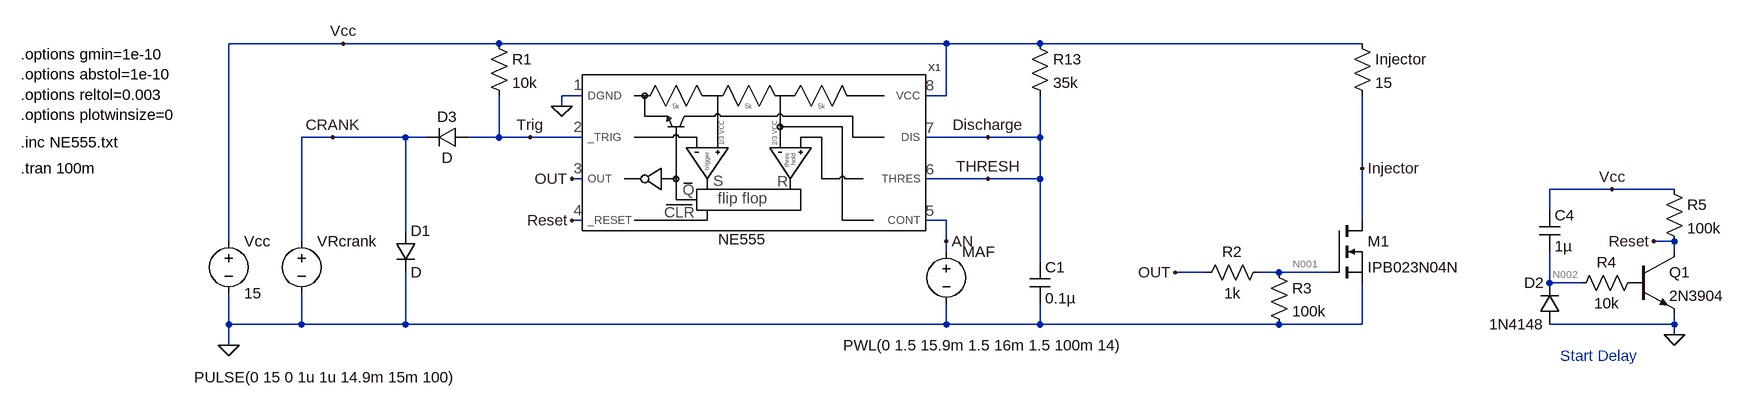
[diagram p0: schematic 555_ECU2.asc]
555_ECU2.asc, the LTspice schematic file:
Version 4
SHEET 1 1560 948
WIRE -576 0 -752 0
WIRE -336 0 -576 0
WIRE 352 0 -336 0
WIRE 496 0 352 0
WIRE 992 0 496 0
WIRE -208 80 -240 80
WIRE 352 80 352 0
WIRE 352 80 320 80
WIRE -240 96 -240 80
WIRE -592 144 -640 144
WIRE -480 144 -592 144
WIRE -448 144 -480 144
WIRE -336 144 -336 80
WIRE -336 144 -384 144
WIRE -288 144 -336 144
WIRE -208 144 -288 144
WIRE 416 144 320 144
WIRE 496 144 496 80
WIRE 496 144 416 144
WIRE 992 192 992 80
WIRE -208 208 -224 208
WIRE 416 208 320 208
WIRE 496 208 496 144
WIRE 496 208 416 208
WIRE 1376 224 1280 224
WIRE 1472 224 1376 224
WIRE 1280 256 1280 224
WIRE -208 272 -224 272
WIRE 352 272 320 272
WIRE 992 272 992 192
WIRE -480 288 -480 144
WIRE -752 304 -752 0
WIRE -640 304 -640 144
WIRE 352 304 352 272
WIRE 1472 304 1440 304
WIRE 352 320 352 304
WIRE 1472 320 1472 304
WIRE 496 336 496 208
WIRE 752 352 704 352
WIRE 864 352 832 352
WIRE 944 352 864 352
WIRE 1280 368 1280 320
WIRE 1328 368 1280 368
WIRE -752 432 -752 384
WIRE -640 432 -640 384
WIRE -640 432 -752 432
WIRE -480 432 -480 352
WIRE -480 432 -640 432
WIRE 352 432 352 400
WIRE 352 432 -480 432
WIRE 496 432 496 400
WIRE 496 432 352 432
WIRE 864 432 496 432
WIRE 992 432 992 368
WIRE 992 432 864 432
WIRE 1472 432 1472 416
WIRE 1472 432 1280 432
WIRE 1472 448 1472 432
WIRE -752 464 -752 432
FLAG -752 464 0
FLAG -224 208 OUT
FLAG -240 96 0
FLAG -592 144 CRANK
FLAG -576 0 Vcc
FLAG -224 272 Reset
FLAG 416 144 Discharge
FLAG 1472 448 0
FLAG 1376 224 Vcc
FLAG 1440 304 Reset
FLAG -288 144 Trig
FLAG 704 352 OUT
FLAG 992 192 Injector
FLAG 352 304 AN
FLAG 416 208 THRESH
SYMBOL cap 480 336 R0
SYMATTR InstName C1
SYMATTR Value 0.1µ
SYMBOL res 480 -16 R0
SYMATTR InstName R13
SYMATTR Value 35k
SYMBOL voltage -752 288 R0
SYMATTR InstName Vcc
SYMATTR Value 15
SYMBOL NE555_sketched 48 176 R0
SYMATTR InstName X1
SYMATTR Prefix ""
SYMATTR Value NE555
SYMBOL voltage -640 288 R0
WINDOW 3 -165 225 Left 2
WINDOW 123 0 0 Left 0
WINDOW 39 0 0 Left 0
SYMATTR Value PULSE(0 15 0 1u 1u 14.9m 15m 100)
SYMATTR InstName VRcrank
SYMBOL diode -496 288 R0
SYMATTR InstName D1
SYMBOL diode -384 128 R90
WINDOW 0 0 32 VBottom 2
WINDOW 3 32 32 VTop 2
SYMATTR InstName D3
SYMBOL npn 1408 320 R0
SYMATTR InstName Q1
SYMATTR Value 2N3904
SYMBOL res 1312 384 R270
WINDOW 0 32 56 VTop 2
WINDOW 3 0 56 VBottom 2
SYMATTR InstName R4
SYMATTR Value 10k
SYMBOL diode 1296 432 R180
WINDOW 0 24 64 Left 2
WINDOW 3 24 0 Left 2
SYMATTR InstName D2
SYMATTR Value 1N4148
SYMBOL res 1456 208 R0
SYMATTR InstName R5
SYMATTR Value 100k
SYMBOL cap 1264 256 R0
SYMATTR InstName C4
SYMATTR Value 1µ
SYMBOL nmos 944 272 R0
SYMATTR InstName M1
SYMATTR Value IPB023N04N
SYMBOL res 976 -16 R0
SYMATTR InstName Injector
SYMATTR Value 15
SYMBOL res 736 368 R270
WINDOW 0 32 56 VTop 2
WINDOW 3 0 56 VBottom 2
SYMATTR InstName R2
SYMATTR Value 1k
SYMBOL res 848 336 R0
SYMATTR InstName R3
SYMATTR Value 100k
SYMBOL res -352 -16 R0
SYMATTR InstName R1
SYMATTR Value 10k
SYMBOL voltage 352 304 R0
WINDOW 123 0 0 Left 0
WINDOW 39 0 0 Left 0
WINDOW 3 -159 160 Left 2
SYMATTR Value PWL(0 1.5 15.9m 1.5 16m 1.5 100m 14)
SYMATTR InstName MAF
TEXT -1072 192 Left 2 !.tran 100m
TEXT -1072 152 Left 2 !.inc NE555.txt
TEXT -1072 16 Left 2 !.options gmin=1e-10\n.options abstol=1e-10\n.options reltol=0.003\n.options plotwinsize=0
TEXT 1296 480 Left 2 ;Start Delay

The netlist it stands for:
* 555_ECU2.asc
C1 THRESH 0 0.1µ
R13 Vcc THRESH 35k
Vcc Vcc 0 15
XX1 0 Trig OUT Reset AN THRESH THRESH Vcc NE555  ; pins DGND _TRIG OUT _RESET CONT THRES DIS VCC
VRcrank CRANK 0 PULSE(0 15 0 1u 1u 14.9m 15m 100)
D1 CRANK 0 D
D3 Trig CRANK D
Q1 Reset P001 0 0 2N3904
R4 N002 P001 10k
D2 0 N002 1N4148
R5 Vcc Reset 100k
C4 Vcc N002 1µ
M1 Injector N001 0 0 IPB023N04N
R§Injector Vcc Injector 15
R2 OUT N001 1k
R3 N001 0 100k
R1 Vcc Trig 10k
V§MAF AN 0 PWL(0 1.5 15.9m 1.5 16m 1.5 100m 14)
.model D D
.lib standard.dio
.model NPN NPN
.model PNP PNP
.lib standard.bjt
.model NMOS NMOS
.model PMOS PMOS
.lib standard.mos
.tran 100m
.inc NE555.txt
.options gmin=1e-10
.options abstol=1e-10
.options reltol=0.003
.options plotwinsize=0
* Start Delay
.backanno
.end

* Results of the author's LTspice run, read from the files saved beside the schematic
* Operating Point, zero values left out:
*   V(thresh) = 1.551 V
*   V(vcc) = 15 V
*   V(an) = 1.5 V
*   V(trig) = 664.4 mV
*   V(reset) = 15 V
*   V(out) = 12.07 V
*   V(p001) = 40.46 mV
*   V(n002) = 40.45 mV
*   V(injector) = 1.831 mV
*   V(n001) = 11.96 V
*   Ic(Q1) = 1.496 nA
*   Ib(Q1) = -1.492 nA
*   Ie(Q1) = -4.101 pA
*   Id(M1) = 999.9 mA
*   Is(M1) = -999.9 mA
*   I(D2) = -1.492 nA
*   I(D3) = 1.434 mA
*   I(R1) = 1.434 mA
*   I(R3) = 119.6 µA
*   I(R2) = 119.6 µA
*   I(Injector) = 999.9 mA
*   I(R5) = 4.282 nA
*   I(R4) = -1.492 nA
*   I(R13) = 384.3 µA
*   I(Maf) = 2.55 mA
*   I(Vrcrank) = 1.434 mA
*   I(Vcc) = -1.008 A
*   Ix(x1:DGND) = -3.797 mA
*   Ix(x1:_TRIG) = -84.85 nA
*   Ix(x1:OUT) = -119.6 µA
*   Ix(x1:_RESET) = 2.786 nA
*   Ix(x1:CONT) = -2.55 mA
*   Ix(x1:THRES) = 242.4 pA
*   Ix(x1:DIS) = 384.3 µA
*   Ix(x1:VCC) = 6.082 mA
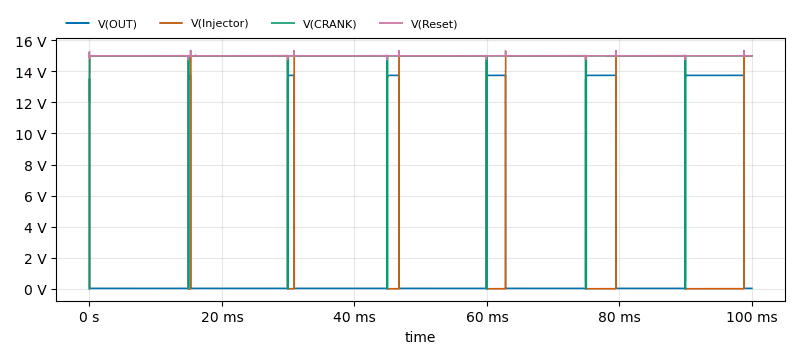
[diagram p1: Transient Analysis of 555_ECU2.asc, plotted from the saved traces]
* Transient Analysis, 1 run:
*   V(OUT): min 23.67 mV, max 13.76 V, average 2.706 V, rms 6.072 V, last 27.15 mV
*   V(Injector): min 1.649 mV, max 15.03 V, average 12.06 V, rms 13.45 V, last 15 V
*   V(CRANK): min 0 V, max 15 V, average 14.91 V, rms 14.96 V, last 15 V
*   V(Reset): min 14.75 V, max 15.35 V, average 15 V, rms 15 V, last 15 V